# Altium schematic sheet DSPCONN.8-11.SCHDOC: Backplane
size B; Engineer: Eric Jonas; Organization: Wilson Lab; Address1: Picower Institute, MIT; Address2: 43 Vassar St. 46-5227; Address3: Cambridge, MA 02139; Address4: Australia 2086
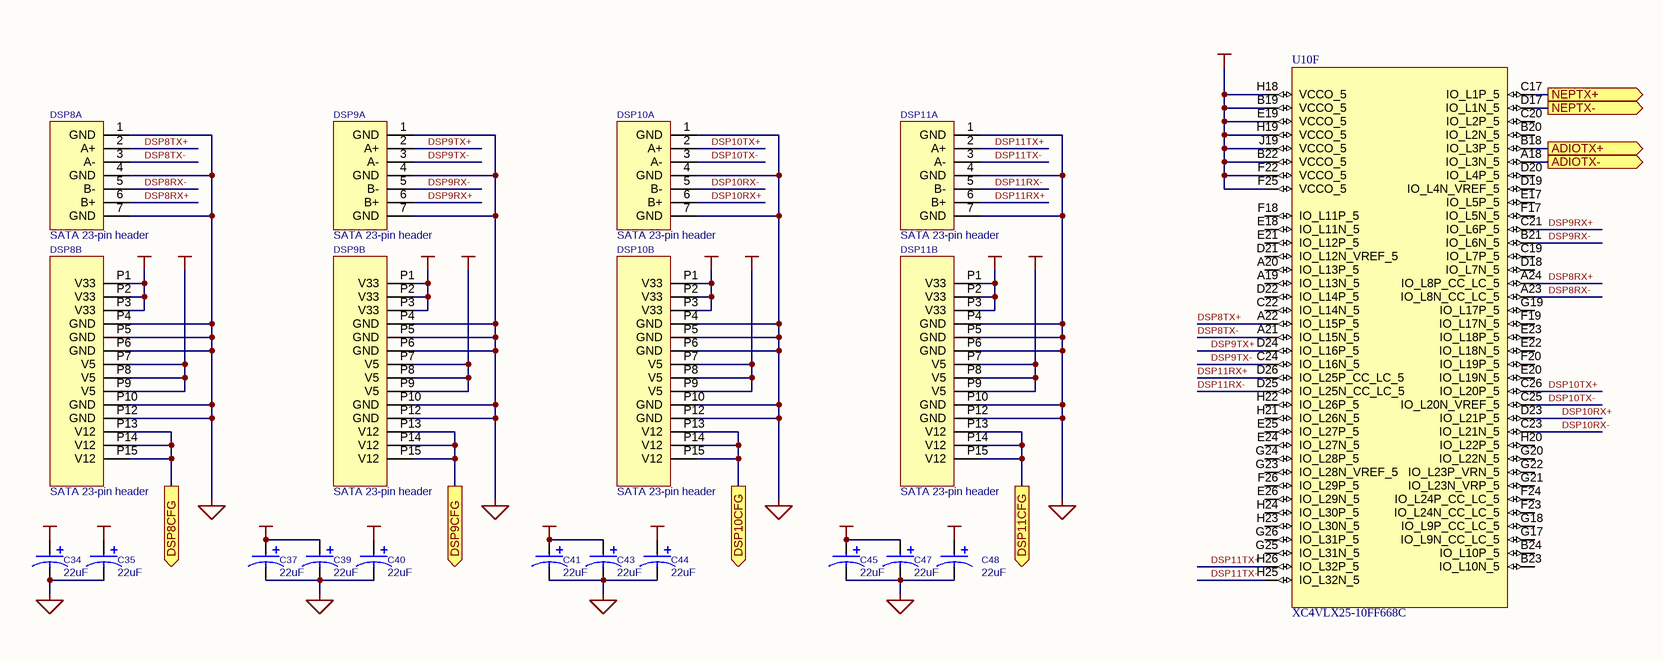
[diagram p0: DSPCONN.8-11.SCHDOC]

## Parts
C34  value 22uF  [6032]  (hidden comment: POLCAP2)
C35  value 22uF  [6032]  (hidden comment: POLCAP2)
C37  value 22uF  [6032]  (hidden comment: POLCAP2)
C39  value 22uF  [6032]  (hidden comment: POLCAP2)
C40  value 22uF  [6032]  (hidden comment: POLCAP2)
C41  value 22uF  [6032]  (hidden comment: POLCAP2)
C43  value 22uF  [6032]  (hidden comment: POLCAP2)
C44  value 22uF  [6032]  (hidden comment: POLCAP2)
C45  value 22uF  [6032]  (hidden comment: POLCAP2)
C47  value 22uF  [6032]  (hidden comment: POLCAP2)
C48  value 22uF  [6032]  (hidden comment: POLCAP2)
DSP8  SATA 23-pin header  [MOLEX 87713-1001]  (parts A,B of 2)
DSP9  SATA 23-pin header  [MOLEX 87713-1001]  (parts A,B of 2)
DSP10  SATA 23-pin header  [MOLEX 87713-1001]  (parts A,B of 2)
DSP11  SATA 23-pin header  [MOLEX 87713-1001]  (parts A,B of 2)
U10  XC4VLX25-10FF668C  [Xilinx FF668]  (part F of 13)

## Ports
ADIOTX+ (out), ADIOTX- (out), DSP8CFG (out), DSP9CFG (out), DSP10CFG (out), DSP11CFG (out), NEPTX+ (out), NEPTX- (out)

## Nets
+2.5VCC: U10.B19(VCCO_5) U10.B22(VCCO_5) U10.E19(VCCO_5) U10.F22(VCCO_5) U10.F25(VCCO_5) U10.H18(VCCO_5) U10.H19(VCCO_5) U10.J19(VCCO_5)
+5VCC: C35.1 C40.1 C44.1 C48.1 DSP8.P7(V5) DSP8.P8(V5) DSP8.P9(V5) DSP9.P7(V5) DSP9.P8(V5) DSP9.P9(V5) DSP10.P7(V5) DSP10.P8(V5) DSP10.P9(V5) DSP11.P7(V5) DSP11.P8(V5) DSP11.P9(V5)
GND: C34.2 C35.2 C37.2 C39.2 C40.2 C41.2 C43.2 C44.2 C45.2 C47.2 C48.2 DSP8.1(GND) DSP8.4(GND) DSP8.7(GND) DSP8.P4(GND) DSP8.P5(GND) DSP8.P6(GND) DSP8.P10(GND) DSP8.P12(GND) DSP9.1(GND) DSP9.4(GND) DSP9.7(GND) DSP9.P4(GND) DSP9.P5(GND) DSP9.P6(GND) DSP9.P10(GND) DSP9.P12(GND) DSP10.1(GND) DSP10.4(GND) DSP10.7(GND) DSP10.P4(GND) DSP10.P5(GND) DSP10.P6(GND) DSP10.P10(GND) DSP10.P12(GND) DSP11.1(GND) DSP11.4(GND) DSP11.7(GND) DSP11.P4(GND) DSP11.P5(GND) DSP11.P6(GND) DSP11.P10(GND) DSP11.P12(GND)
VCC2: C34.1 C37.1 C39.1 C41.1 C43.1 C45.1 C47.1 DSP8.P1(V33) DSP8.P2(V33) DSP8.P3(V33) DSP9.P1(V33) DSP9.P2(V33) DSP9.P3(V33) DSP10.P1(V33) DSP10.P2(V33) DSP10.P3(V33) DSP11.P1(V33) DSP11.P2(V33) DSP11.P3(V33)
ADIOTX+: U10.B18(IO_L3P_5) ; port ADIOTX+
ADIOTX-: U10.A18(IO_L3N_5) ; port ADIOTX-
DSP8CFG: DSP8.P13(V12) DSP8.P14(V12) DSP8.P15(V12) ; port DSP8CFG
DSP8RX+: DSP8.6(B+) U10.A24(IO_L8P_CC_LC_5)
DSP8RX-: DSP8.5(B-) U10.A23(IO_L8N_CC_LC_5)
DSP8TX+: DSP8.2(A+) U10.A22(IO_L15P_5)
DSP8TX-: DSP8.3(A-) U10.A21(IO_L15N_5)
DSP9CFG: DSP9.P13(V12) DSP9.P14(V12) DSP9.P15(V12) ; port DSP9CFG
DSP9RX+: DSP9.6(B+) U10.C21(IO_L6P_5)
DSP9RX-: DSP9.5(B-) U10.B21(IO_L6N_5)
DSP9TX+: DSP9.2(A+) U10.D24(IO_L16P_5)
DSP9TX-: DSP9.3(A-) U10.C24(IO_L16N_5)
DSP10CFG: DSP10.P13(V12) DSP10.P14(V12) DSP10.P15(V12) ; port DSP10CFG
DSP10RX+: DSP10.6(B+) U10.D23(IO_L21P_5)
DSP10RX-: DSP10.5(B-) U10.C23(IO_L21N_5)
DSP10TX+: DSP10.2(A+) U10.C26(IO_L20P_5)
DSP10TX-: DSP10.3(A-) U10.C25(IO_L20N_VREF_5)
DSP11CFG: DSP11.P13(V12) DSP11.P14(V12) DSP11.P15(V12) ; port DSP11CFG
DSP11RX+: DSP11.6(B+) U10.D26(IO_L25P_CC_LC_5)
DSP11RX-: DSP11.5(B-) U10.D25(IO_L25N_CC_LC_5)
DSP11TX+: DSP11.2(A+) U10.H26(IO_L32P_5)
DSP11TX-: DSP11.3(A-) U10.H25(IO_L32N_5)
NEPTX+: U10.C17(IO_L1P_5) ; port NEPTX+
NEPTX-: U10.D17(IO_L1N_5) ; port NEPTX-

Not connected (* = marked no-connect by the designer): U10 A19(IO_L13N_5) A20(IO_L13P_5) B20(IO_L2N_5) B23(IO_L10N_5) B24(IO_L10P_5) C19(IO_L7P_5) C20(IO_L2P_5) C22(IO_L14N_5) D18(IO_L7N_5) D19(IO_L4N_VREF_5) D20(IO_L4P_5) D21(IO_L12N_VREF_5) D22(IO_L14P_5) E17(IO_L5P_5) E18(IO_L11N_5) E20(IO_L19N_5) E21(IO_L12P_5) E22(IO_L18N_5) E23(IO_L18P_5) E24(IO_L27N_5) E25(IO_L27P_5) E26(IO_L29N_5) F17(IO_L5N_5) F18(IO_L11P_5) F19(IO_L17N_5) F20(IO_L19P_5) F23(IO_L24N_CC_LC_5) F24(IO_L24P_CC_LC_5) F26(IO_L29P_5) G17(IO_L9N_CC_LC_5) G18(IO_L9P_CC_LC_5) G19(IO_L17P_5) G20(IO_L22N_5) G21(IO_L23N_VRP_5) G22(IO_L23P_VRN_5) G23(IO_L28N_VREF_5) G24(IO_L28P_5) G25(IO_L31N_5) G26(IO_L31P_5) H20(IO_L22P_5) H21(IO_L26N_5) H22(IO_L26P_5) H23(IO_L30N_5) H24(IO_L30P_5)

## Notes on the sheet
- Title:
- Engineer:
- Date:
- Revision:
- Sheet
- of
- File:

## Library data of the parts
C34 C35 C37 C39-C41 C43-C45 C47 C48 = POLCAP2: Standard Capacitor
DSP8-DSP11 = SATA-23
U10 = XC4VLX25-10FF668C: Xilinx Virtex-4